# EAGLE design IOP_1_1 (EAGLE 8.3.2)
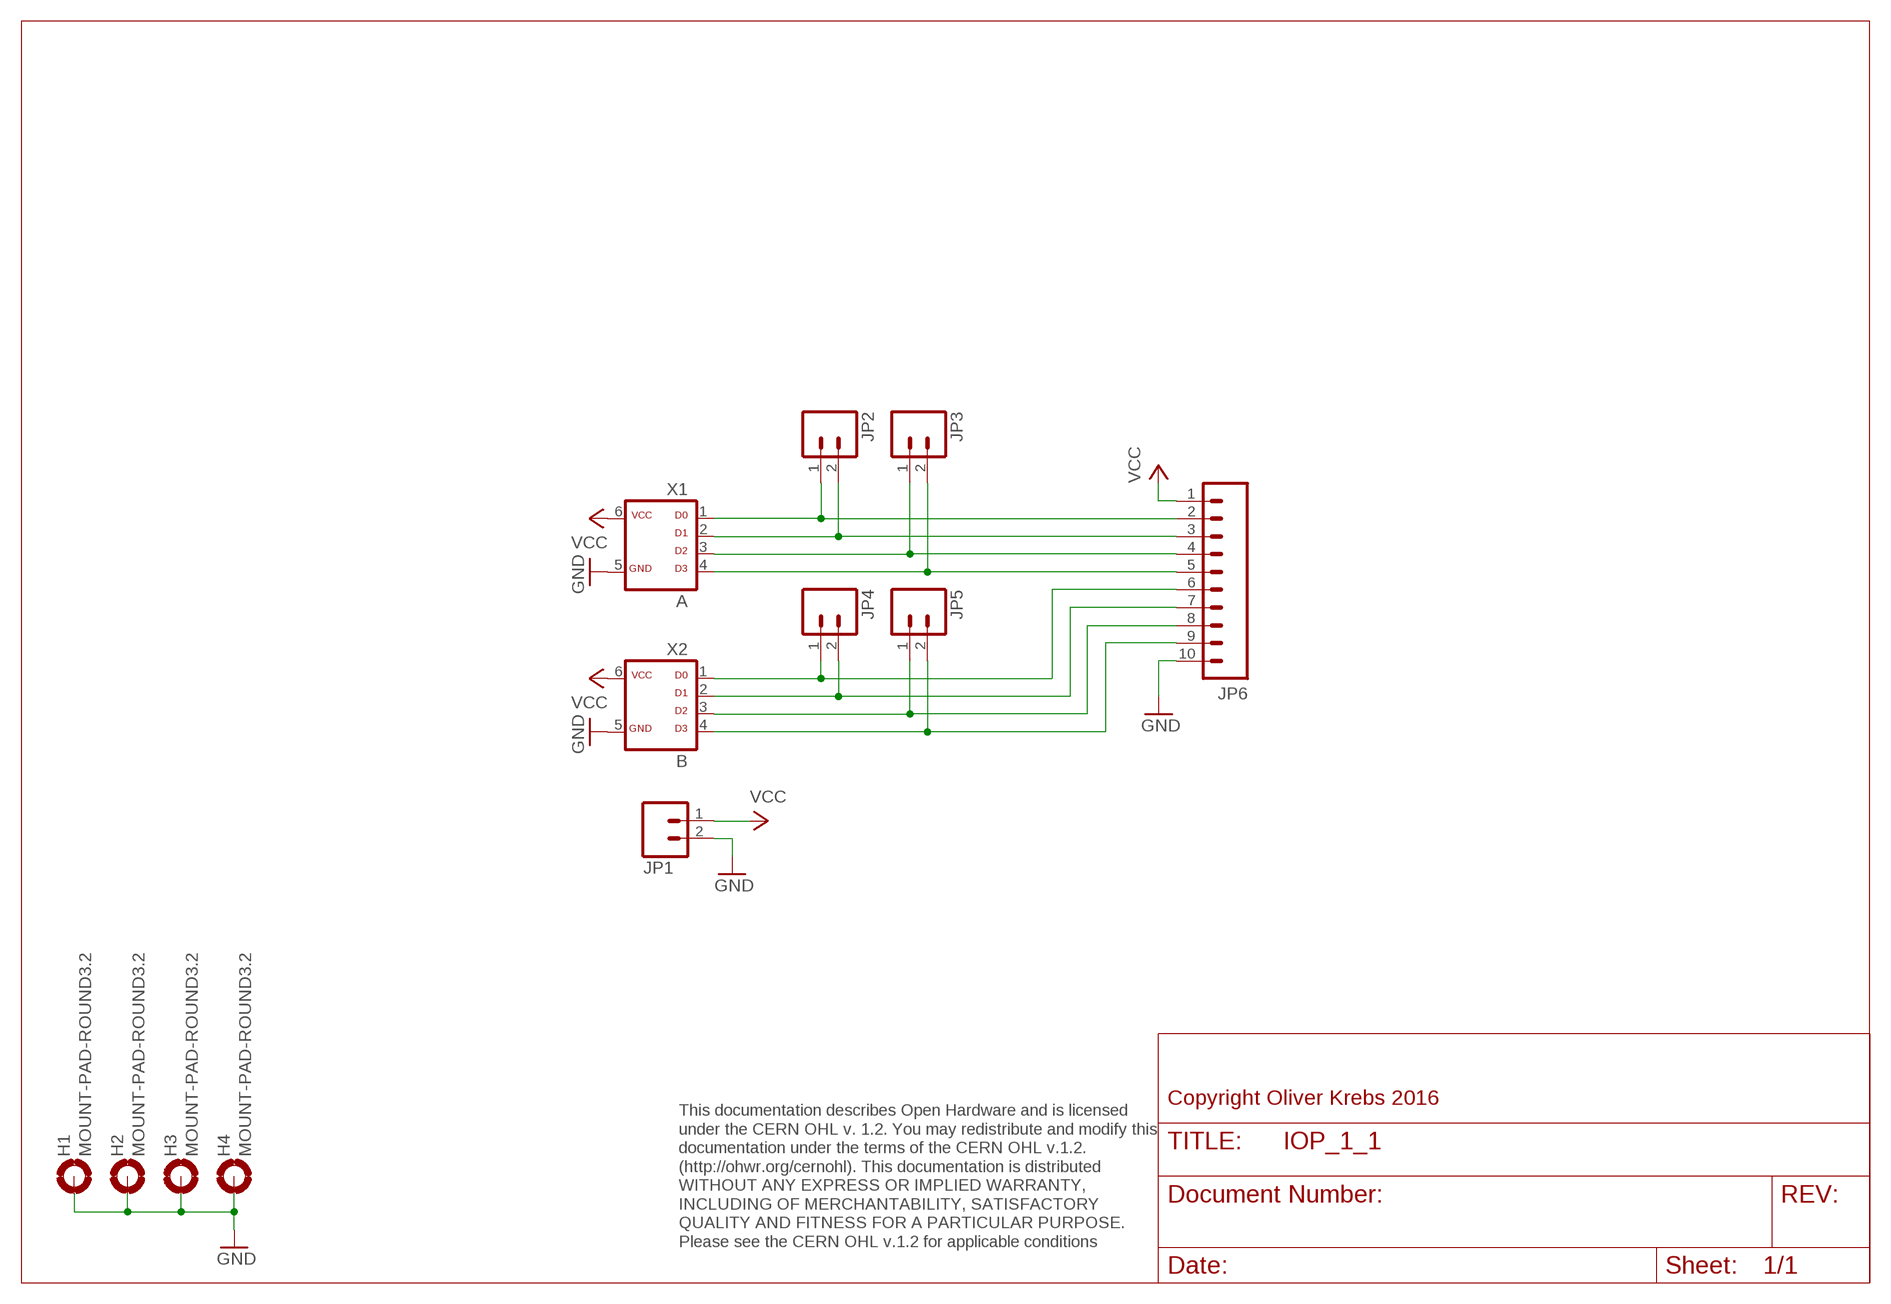
[diagram p0: schematic, sheet 1]

## Parts
H1  MOUNT-PAD-ROUND3.2  [3,2-PAD]
H2  MOUNT-PAD-ROUND3.2  [3,2-PAD]
H3  MOUNT-PAD-ROUND3.2  [3,2-PAD]
H4  MOUNT-PAD-ROUND3.2  [3,2-PAD]
JP1  M021.3MM-5.08  [1X02_BIG_5.08]
JP2  M021.3MM-5.08  [1X02_BIG_5.08]
JP3  M021.3MM-5.08  [1X02_BIG_5.08]
JP4  M021.3MM-5.08  [1X02_BIG_5.08]
JP5  M021.3MM-5.08  [1X02_BIG_5.08]
JP6  M10SILK_FEMALE_PTH  [1X10]
X1  A  ML6D  [ML-6]
X2  B  ML6D  [ML-6]

## Nets
GND: H1.B3,2(MOUNT) H2.B3,2(MOUNT) H3.B3,2(MOUNT) H4.B3,2(MOUNT) JP1.2 JP6.10 X1.5 X2.5
N$1: JP2.2 JP6.3 X1.2
N$2: JP2.1 JP6.2 X1.1
N$3: JP3.1 JP6.4 X1.3
N$4: JP3.2 JP6.5 X1.4
N$5: JP4.1 JP6.6 X2.1
N$6: JP4.2 JP6.7 X2.2
N$7: JP5.1 JP6.8 X2.3
N$8: JP5.2 JP6.9 X2.4
VCC: JP1.1 JP6.1 X1.6 X2.6

## Notes on the sheet
- Copyright Oliver Krebs 2016
- This documentation describes Open Hardware and is licensed 
  under the CERN OHL v. 1.2. You may redistribute and modify this 
  documentation under the terms of the CERN OHL v.1.2. 
  (http://ohwr.org/cernohl). This documentation is distributed
  WITHOUT ANY EXPRESS OR IMPLIED WARRANTY, 
  INCLUDING OF MERCHANTABILITY, SATISFACTORY 
  QUALITY AND FITNESS FOR A PARTICULAR PURPOSE. 
  Please see the CERN OHL v.1.2 for applicable conditions

## Library data of the parts
H1-H4 = holes:MOUNT-PAD-ROUND: MOUNTING PAD, round
JP1-JP5 = SparkFun-Connectors:M02: Standard 2-pin 0.1" header. Use with - straight break away headers ( PRT-00116) - right angle break away headers (PRT-00553) - swiss pins (PRT-00743) - machine pins (PRT-00117) - female headers (PRT-00115) Molex polarized connector foot print use with: PRT-08233 with associated crimp pins and housings. 2.54_SCREWTERM for use with PRT-10571. 3.5mm Screw Terminal footprints for PRT-08084 5mm Screw Terminal footprints for use with PRT-08432
JP6 = SparkFun-Connectors:M10: Header 10 Standard 10-pin 0.1" header. Use with straight break away headers (SKU : PRT-00116), right angle break away headers (PRT-00553), swiss pins (PRT-00743), machine pins (PRT-00117), and female headers (PRT-00115).; PROD_ID: CONN-11563
X1 X2 = 01-my-con:ML6D

## Board
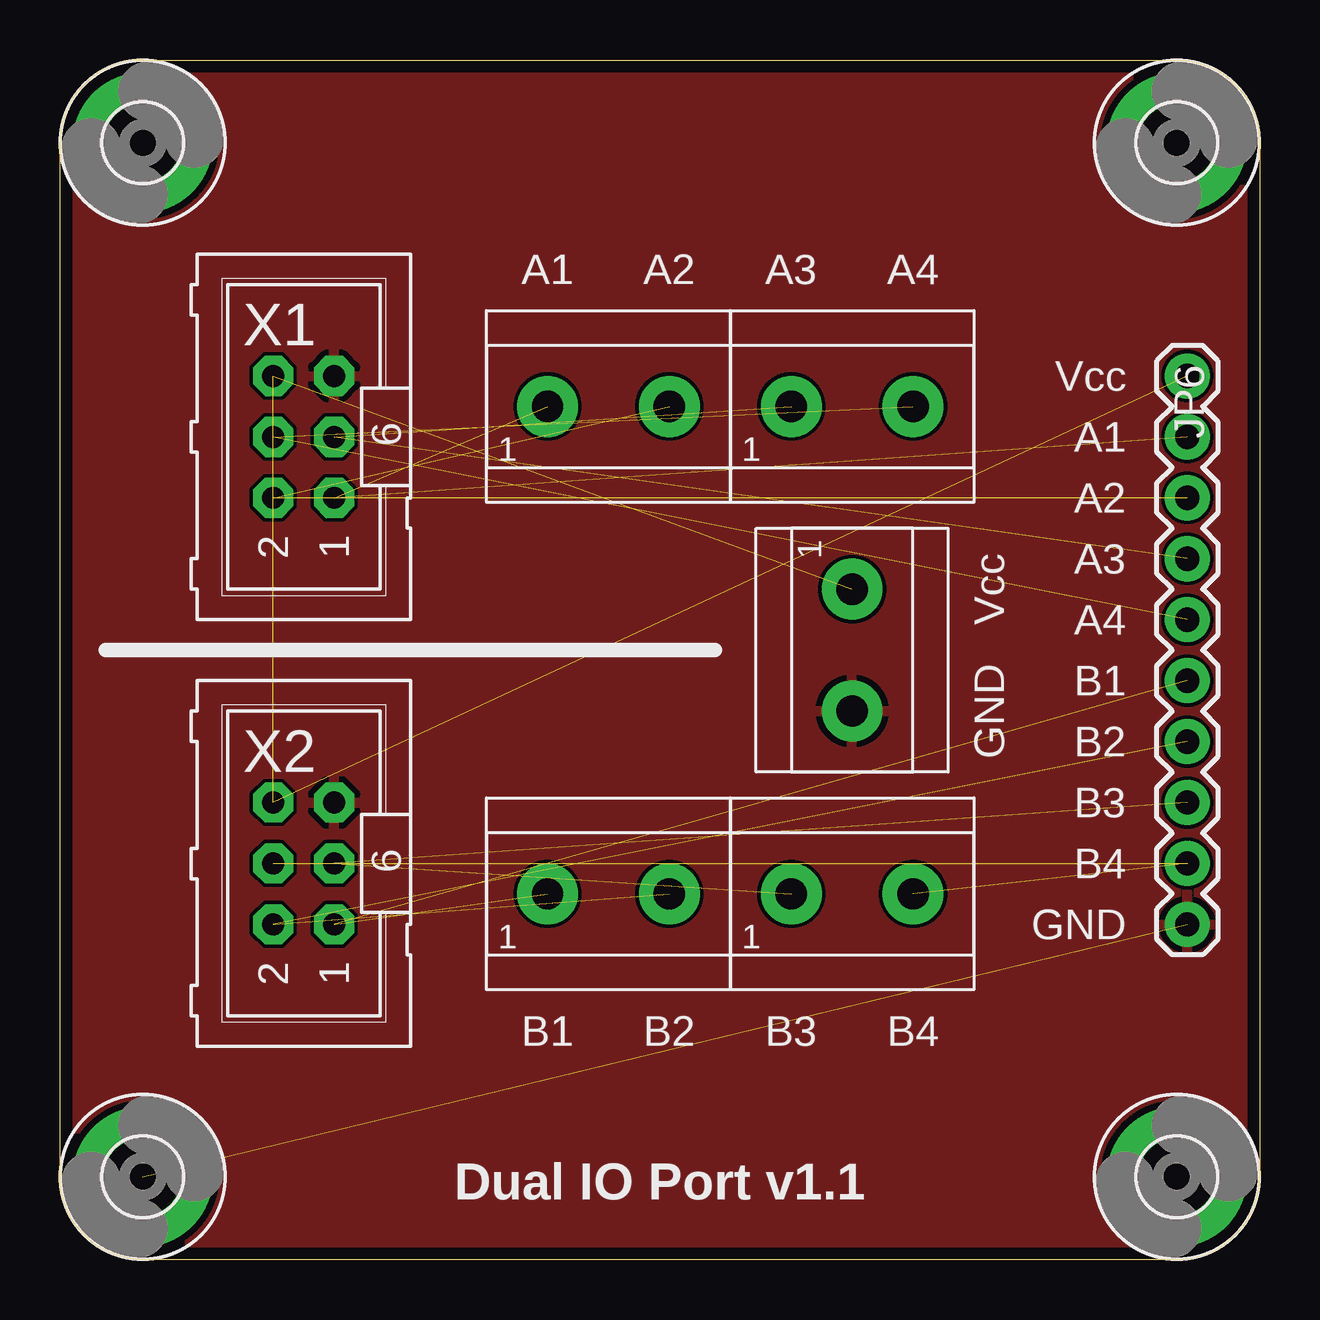
[diagram p1: board, top side]
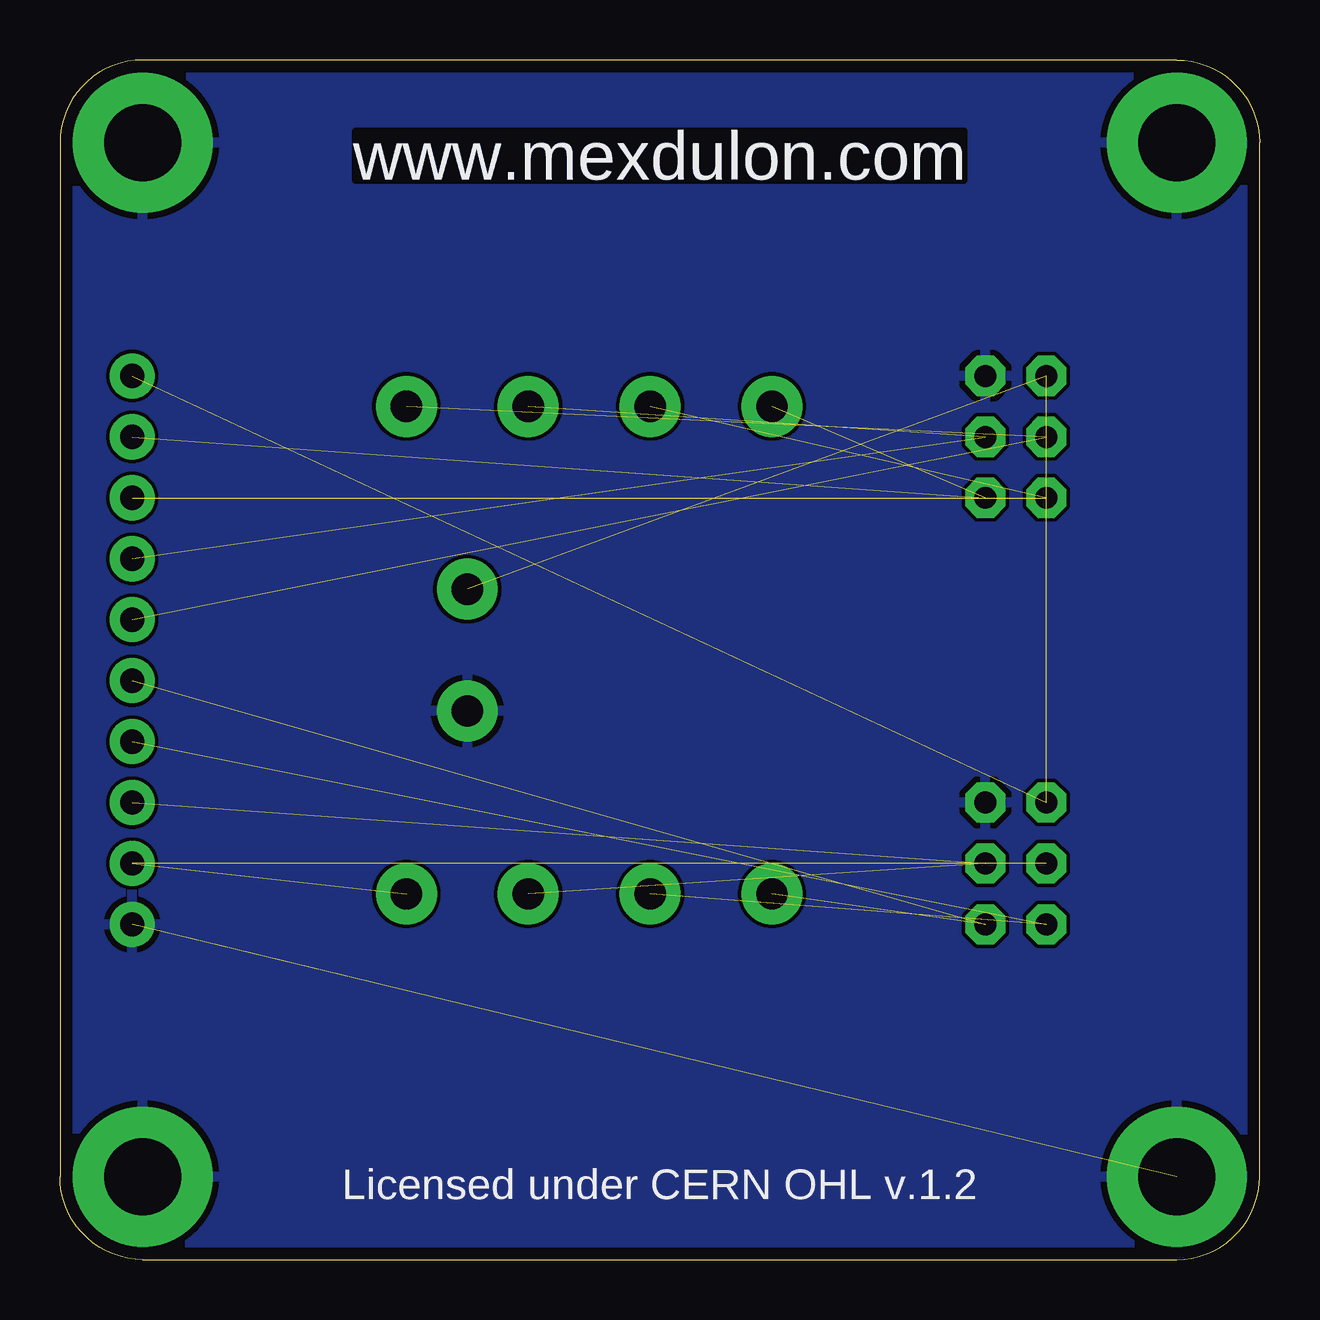
[diagram p2: board, bottom side, seen from below]

Size 50 x 50 mm. Coordinates in mm from the lower left corner, seen from the top.
Outline: 0,3.45 0,46.55 arc-90 3.45,50 46.55,50 arc-90 50,46.55 50,3.45 arc-90 46.55,0 3.45,0 arc-90 0,3.45
Copper layers (1*16): Top 0.035mm / dielectric 1.6mm / Bottom 0.035mm
Design rules "Elecrow_2-layer_PCB_eagle_rule": minimum track width 6mil, minimum drill 12mil, track to track 6mil, track to pad 6mil, pad to pad 6mil, via to via 8mil, smd to smd 0mil, copper to edge 20mil, drill to drill 10mil, minimum pad ring 6mil, minimum via ring 6mil, stop-mask expansion 0mil, vias tented up to drill 100mil, thermal gap 10mil

### Footprints (pad centres in the part's own frame; a part is rotated, then mirrored left to right if it is on the bottom)
3,2-PAD = drill 3.2 pad 5.842: B3,2 0,0
1X02_BIG_5.08 = drill 1.3 pad 2.54: 1 -2.54,0; 2 2.54,0
1X10 = drill 1.016 pad 1.88: 1 0,0; 2 2.54,0; 3 5.08,0; 4 7.62,0; 5 10.16,0; 6 12.7,0; 7 15.24,0; 8 17.78,0; 9 20.32,0; 10 22.86,0
ML-6 = drill 0.914 pad 1.676 octagon: 1 -2.54,-1.27; 2 -2.54,1.27; 3 0,-1.27; 4 0,1.27; 5 2.54,-1.27; 6 2.54,1.27

### Placement (x,y rotation side)
H1  3.45,3.45 0 top
H2  3.45,46.55 0 top
H3  46.55,3.45 0 top
H4  46.55,46.55 0 top
JP1  33.02,25.4 270 top
JP2  22.86,35.56 0 top
JP3  33.02,35.56 0 top
JP4  22.86,15.24 0 top
JP5  33.02,15.24 0 top
JP6  46.99,36.83 270 top
X1  10.16,34.29 90 top
X2  10.16,16.51 90 top

### Tracks (layer width: path | path; a pad name or v marks a point on that pad's centre or on a via)
GND  (1 unrouted)
  pour Bottom: 0,0 50.8,0 50.8,50.8 0,50.8
  pour Top: 0,50.16 50.16,50.16 50.16,0 0,0
N$1  (2 unrouted)
N$2  (2 unrouted)
N$3  (2 unrouted)
N$4  (2 unrouted)
N$5  (2 unrouted)
N$6  (2 unrouted)
N$7  (2 unrouted)
N$8  (2 unrouted)
VCC  (3 unrouted)

### Text on the board
Bottom: www.mexdulon.com
tNames: A1 | A2 | A3 | A4 | Vcc | A1 | A2 | A3 | Vcc | A4 | GND | B1 | B2 | B3 | B4 | GND | B1 | B2 | B3 | B4 | Dual IO Port v1.1
bNames: www.mexdulon.com | Licensed under CERN OHL v.1.2